# EAGLE design jetson_ros_button (EAGLE 8.5.0)
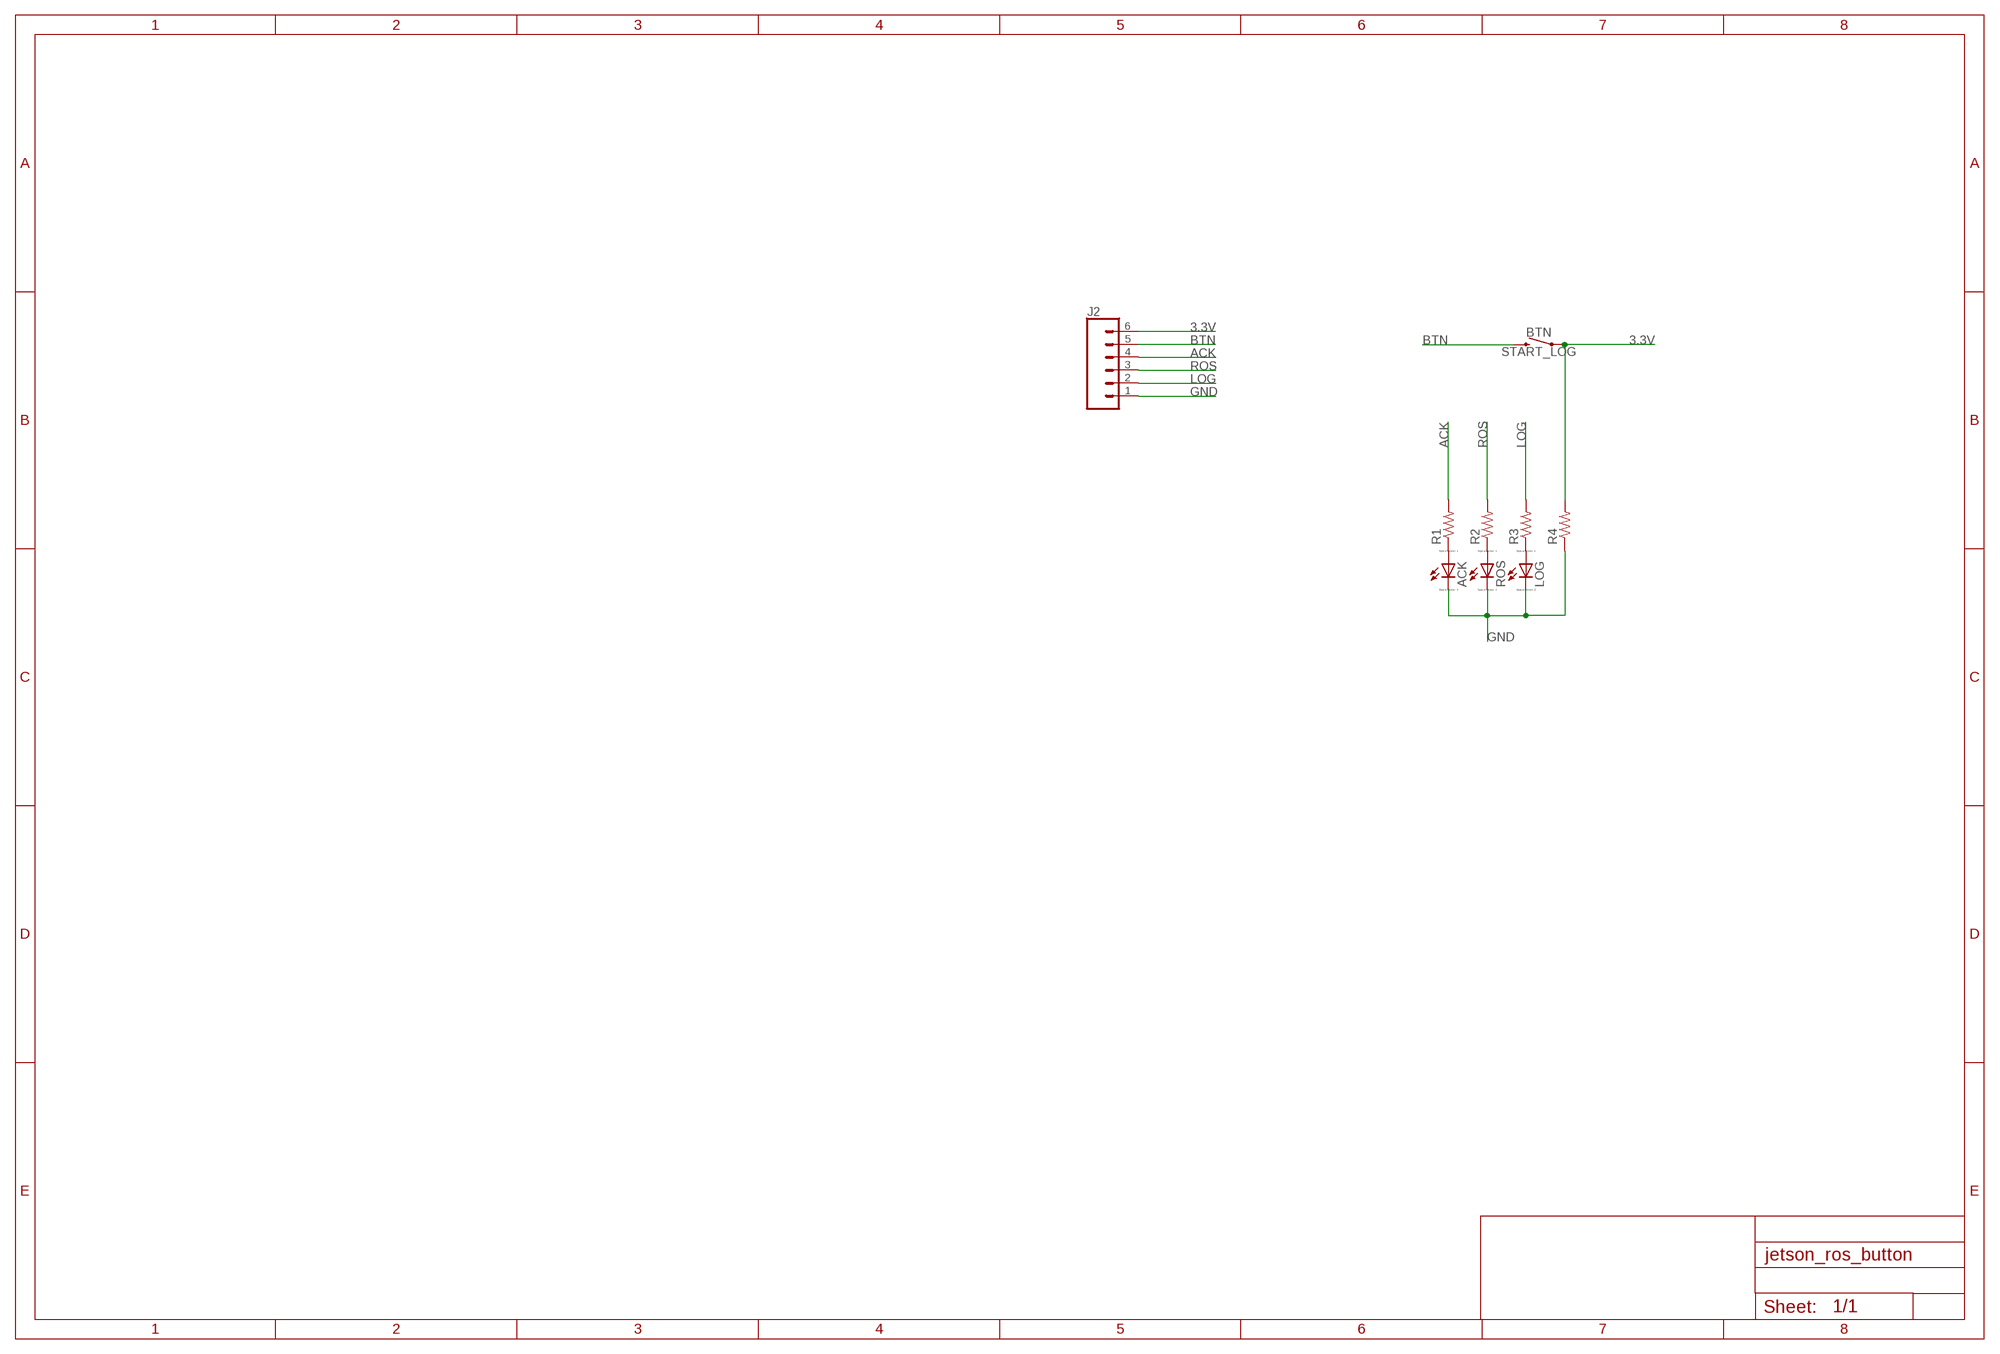
[diagram p0: schematic, sheet 1]

## Parts
ACK  LED_E  [LED_1206]
BTN  START_LOG  MOMENTARY-SWITCH-SPST-PTH-6.0MM  [TACTILE_SWITCH_PTH_6.0MM]
J2  CONN_06SILK_FEMALE_PTH  [1X06]
LOG  LED_E  [LED_1206]
R1  R-US_0204/7  [0204/7]
R2  R-US_0204/7  [0204/7]
R3  R-US_0204/7  [0204/7]
R4  R-US_0204/7  [0204/7]
ROS  LED_E  [LED_1206]

## Nets
3.3V: BTN.1 J2.6 R4.2
ACK: J2.4 R1.2
BTN: BTN.3 J2.5
GND: ACK.C J2.1 LOG.C R4.1 ROS.C
LOG: J2.2 R3.2
N$1: ACK.A R1.1
N$2: R2.1 ROS.A
N$3: LOG.A R3.1
ROS: J2.3 R2.2

## Library data of the parts
ACK LOG ROS = eagle-ltspice:LED_E: LED Source: http://www.osram.convergy.de Source: www.luxeon.com Source: www.kingbright.com; SPICEMODEL: NONE; SPICEPREFIX: D; SPICETYPE: diode
BTN = SparkFun-Switches:MOMENTARY-SWITCH-SPST: Momentary Switch (Pushbutton) - SPST Normally-open (NO) SPST momentary switches (buttons, pushbuttons). Variants PTH-12MM - 12mm square, through-hole Momentary Pushbutton Switch - 12mm Square <https://www.sparkfun.com/products/9190> (COM-09190) PTH-6.0MM, PTH-6.0MM-KIT - 6.0mm square, through-hole Mini Pushbutton Switch <https://www.sparkfun.com/products/97> (COM-00097) KIT package intended for soldering kit's - only one side of pads' copper is exposed. PTH-RIGHT-ANGLE-KIT - Right-angle, through-hole Right Angle Tactile Button <https://www.sparkfun.com/products/10791> - Used on SparkFun BigTime Watch Kit <https://www.sparkfun.com/products/11734> SMD-12MM - 12mm square, surface-mount Tactile Button - SMD (12mm) <https://www.sparkfun.com/products/12993> (COM-12993) Used on SparkFun PicoBoard <https://www.sparkfun.com/products/11888> SMD-4.5MM - 4.5mm Square Trackball Switch Used on SparkFun Blackberry Trackballer Breakout <https://www.sparkfun.com/products/13169> SMD-4.6MMX2.8MM - 4.60mm x 2.80mm, surface mount Used on SparkFun SAMD21 Mini Breakout <https://www.sparkfun.com/products/13664> SMD-5.2MM, SMD-5.2-REDUNDANT - 5.2mm square, surface-mount Mini Pushbutton Switch - SMD <https://www.sparkfun.com/products/8720> (COM-08720) Used on Arduino Pro Mini <https://www.sparkfun.com/products/11114> REDUNDANT package connects both switch circuits together SMD-6.0X3.5MM - 6.0 x 3.5mm, surface mount Momentary Reset Switch SMD <https://www.sparkfun.com/products/8229> (COM-08229) SMD-6.2MM-TALL - 6.2mm square, surface mount Tactile Button - SMD (6mm) <https://www.sparkfun.com/products/12992> Used on SparkFun Digital Sandbox <https://www.sparkfun.com/products/12651> SMD-RIGHT-ANGLE - Right-angle, surface mount Used on SparkFun Block for Intel® Edison - Arduino <https://www.sparkfun.com/products/13036>; PROD_ID: SWCH-08441; SF_SKU: COM-00097
J2 = SparkFun-Connectors:CONN_06: Multi connection point. Often used as Generic Header-pin footprint for 0.1 inch spaced/style header connections On any of the 0.1 inch spaced packages, you can populate with these: Break Away Headers - Straight <https://www.sparkfun.com/products/116> (PRT-00116) Break Away Male Headers - Right Angle <https://www.sparkfun.com/products/553> (PRT-00553) Female Headers <https://www.sparkfun.com/products/115> (PRT-00115) Break Away Headers - Machine Pin <https://www.sparkfun.com/products/117> (PRT-00117) Break Away Female Headers - Swiss Machine Pin <https://www.sparkfun.com/products/743> (PRT-00743) Arduino Stackable Header - 6 Pin <https://www.sparkfun.com/products/9280> (PRT-09280) For SCREWTERMINALS and SPRING TERMINALS visit here: Screw Terimnals on SparkFun.com <https://www.sparkfun.com/search/results?term=Screw+Terminals> (5mm/3.5mm/2.54mm spacing) This device is also useful as a general connection point to wire up your design to another part of your project. Our various solder wires solder well into these plated through hole pads. Hook-Up Wire - Assortment (Stranded, 22 AWG) <https://www.sparkfun.com/products/11375> (PRT-11375) Hook-Up Wire - Assortment (Solid Core, 22 AWG) <https://www.sparkfun.com/products/11367> (PRT-11367) View the entire wire category on our website here <https://www.sparkfun.com/categories/141>; PROD_ID: CONN-08437
R1-R4 = rcl:R-US_: RESISTOR, American symbol; SPICEPREFIX: R

## Board
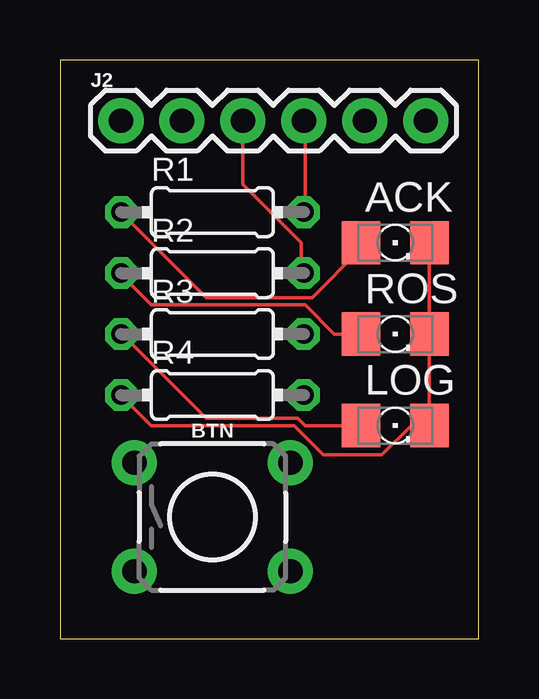
[diagram p1: board, top side]
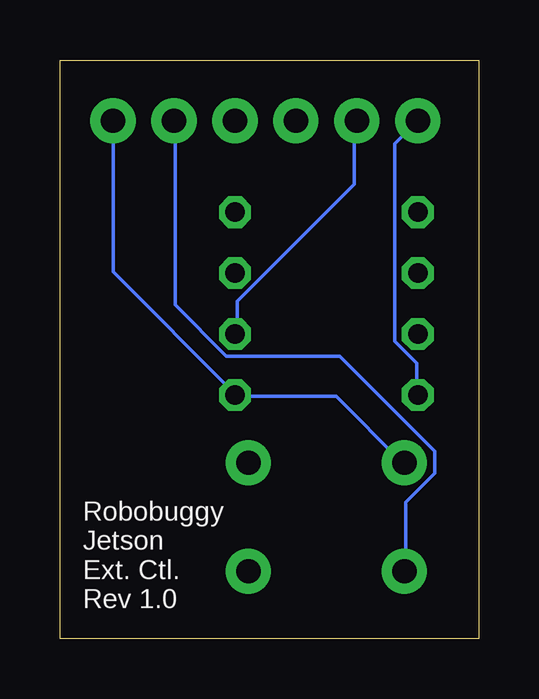
[diagram p2: board, bottom side, seen from below]

Size 17.45 x 24.12 mm. Coordinates in mm from the lower left corner, seen from the top.
Outline: 0,0 17.45,0 17.45,24.12 0,24.12 0,0
Copper layers (1*16): Top 0.035mm / dielectric 1.5mm / Bottom 0.035mm
Design rules "default": minimum track width 6mil, minimum drill 0.35mm, track to track 6mil, track to pad 6mil, pad to pad 6mil, via to via 6mil, smd to smd 6mil, copper to edge 40mil, drill to drill 6mil, minimum pad ring 10mil, minimum via ring 8mil, stop-mask expansion 4mil, vias tented up to drill 0mil, thermal gap 10mil

### Footprints (pad centres in the part's own frame; a part is rotated, then mirrored left to right if it is on the bottom)
LED_1206 = smd 1.6 x 1.803: A -1.422,0; C 1.422,0
TACTILE_SWITCH_PTH_6.0MM = drill 1.016 pad 1.88: 1 -3.251,2.261; 2 3.251,2.261; 3 -3.251,-2.261; 4 3.251,-2.261
1X06 = drill 1.016 pad 1.88: 1 0,0; 2 2.54,0; 3 5.08,0; 4 7.62,0; 5 10.16,0; 6 12.7,0
0204/7 = drill 0.813 octagon: 1 -3.81,0; 2 3.81,0

### Placement (x,y rotation side)
ACK  13.97,16.51 0 top
BTN  6.35,5.08 0 top
J2  2.54,21.59 0 top
LOG  13.97,8.89 0 top
R1  6.35,17.78 0 top
R2  6.35,15.24 0 top
R3  6.35,12.7 0 top
R4  6.35,10.16 0 top
ROS  13.97,12.7 0 top

### Tracks (layer width: path | path; a pad name or v marks a point on that pad's centre or on a via)
3.3V
  Bottom 0.152: BTN.1 3.2,7.37 5.94,10.11 10.06,10.11 R4.2 10.21,10.26 15.24,15.29 J2.6
ACK
  Top 0.152: R1.2 10.21,17.88 10.21,21.54 J2.4
BTN
  Bottom 0.152: BTN.3 3.05,2.95 3.05,5.69 1.83,6.91 1.83,7.82 5.79,11.79 10.52,11.79 12.65,13.92 12.65,21.54 J2.5
GND
  Top 0.152: ROS.C LOG.C | LOG.C | ROS.C ACK.C | ACK.C | ROS.C | LOG.C 14.63,8.89 13.41,7.67 10.97,7.67 9.75,8.89 3.81,8.89 R4.1
  Bottom 0.152: J2.1 3.5,20.62 3.5,12.4 2.59,11.48 2.59,10.26 R4.1
LOG
  Bottom 0.152: R3.2 10.06,12.7 10.06,14.07 5.18,18.95 5.18,21.54 J2.2
N$1
  Top 0.152: R1.1 6.1,14.22 10.52,14.22 12.5,16.2 12.5,16.51 ACK.A
N$2
  Top 0.152: ROS.A 11.43,12.7 10.21,13.92 3.81,13.92 2.59,15.14 R2.1
N$3
  Top 0.152: LOG.A 10.21,8.89 9.91,9.2 6.1,9.2 2.59,12.7 R3.1
ROS
  Top 0.152: J2.3 7.62,18.95 10.06,16.51 10.06,15.29 R2.2

### Text on the board
bNames: Robobuggy / Jetson / Ext. Ctl. / Rev 1.0